# Altium schematic sheet Power_Supply.SchDoc
size B
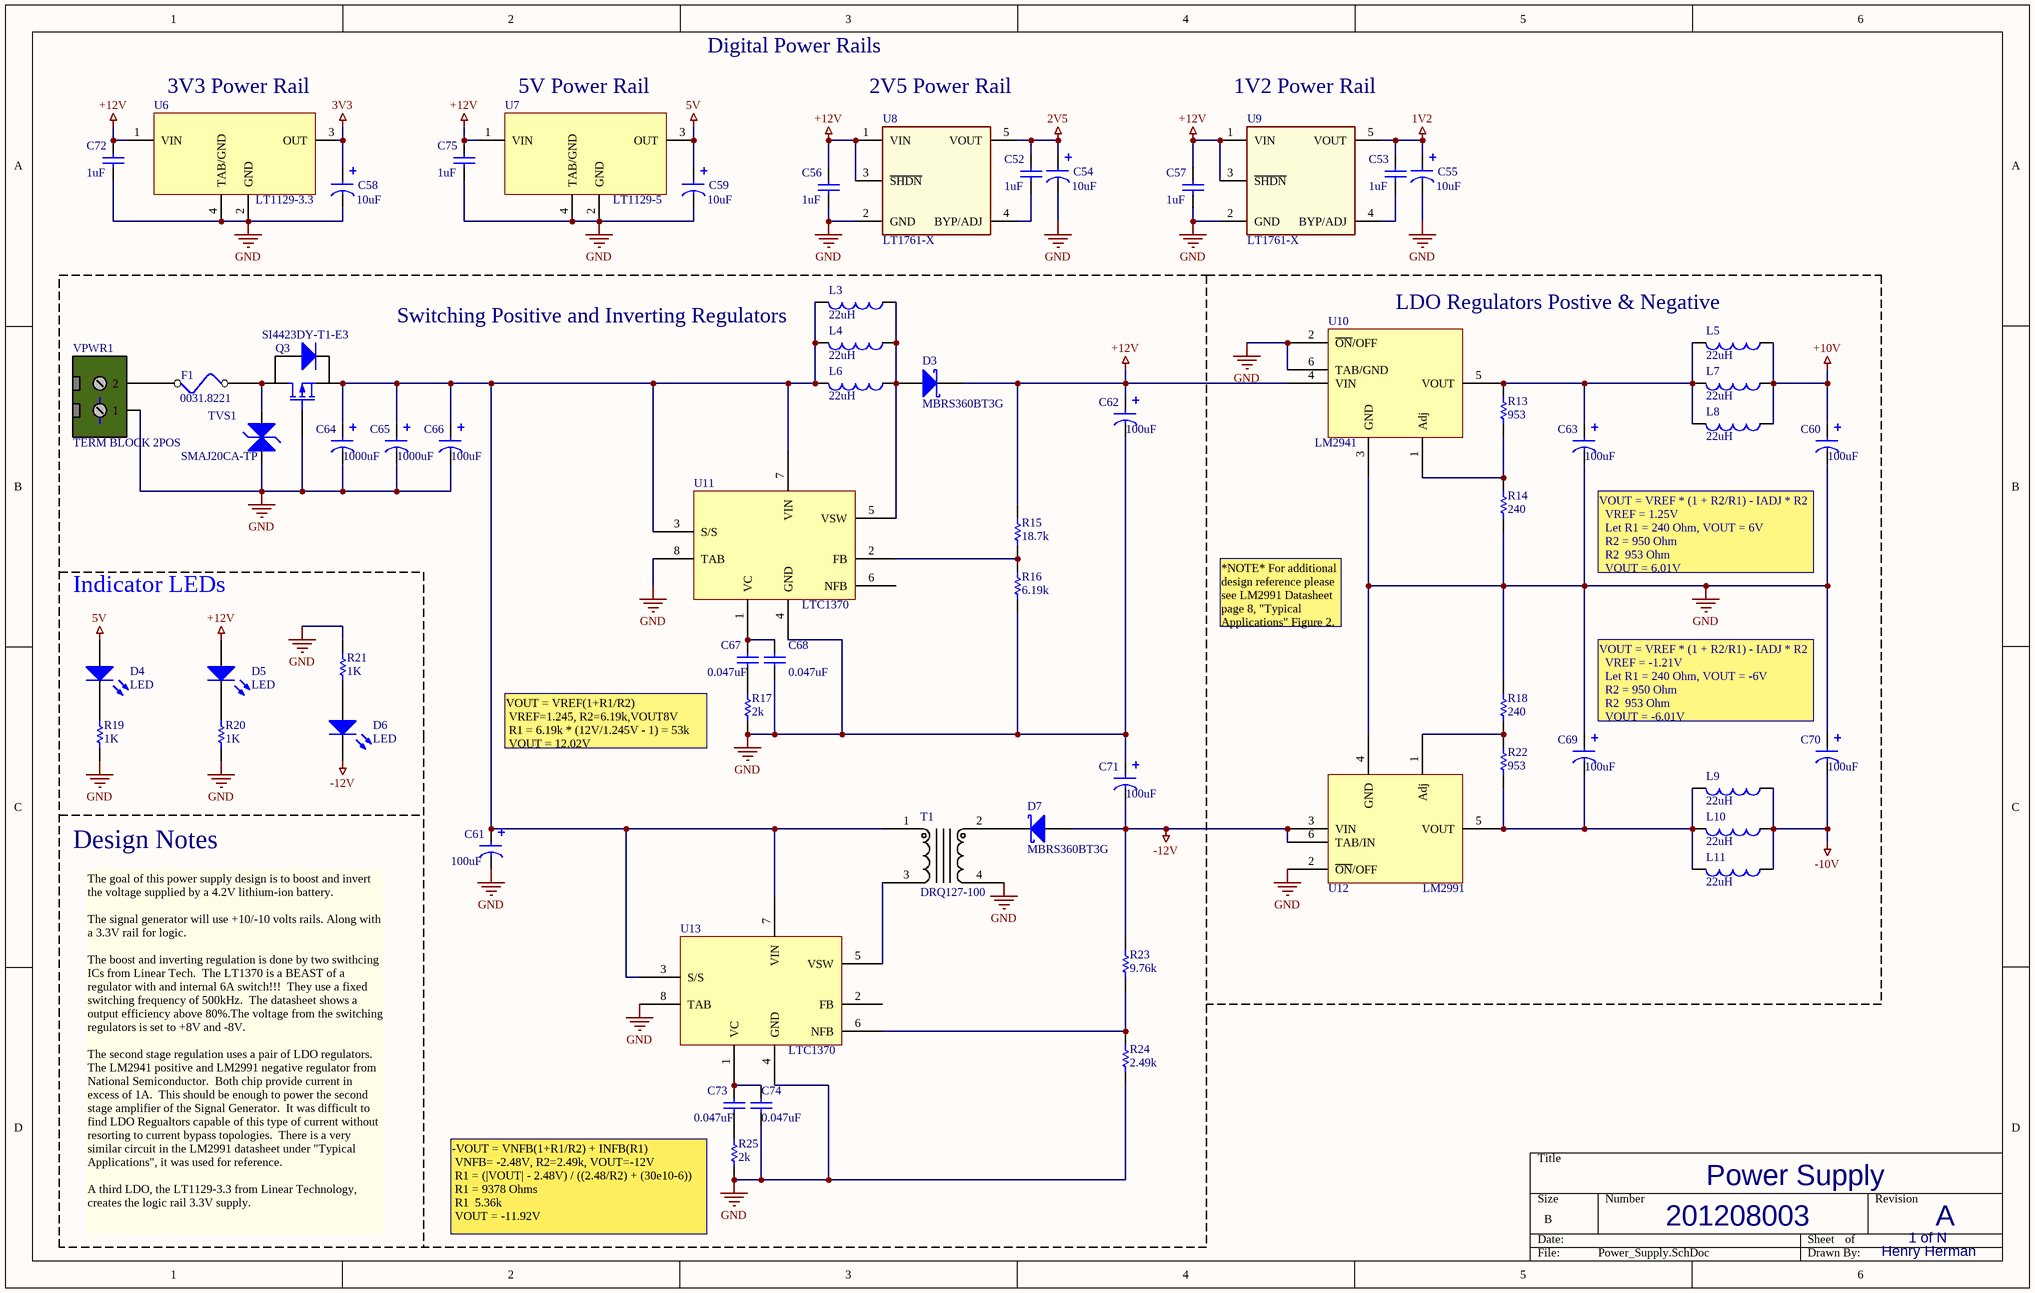
[diagram p0: Power_Supply.SchDoc]

## Parts
C52  Label: 1uF  [SM/C_0603]  (hidden comment: CAP)
C53  Label: 1uF  [SM/C_0603]  (hidden comment: CAP)
C54  Label: 10uF  [SM/C_POL_0805]  (hidden comment: CAP_POL)
C55  Label: 10uF  [SM/C_POL_0805]  (hidden comment: CAP_POL)
C56  Label: 1uF  [SM/C_0603]  (hidden comment: CAP)
C57  Label: 1uF  [SM/C_0603]  (hidden comment: CAP)
C58  value 10uF  [SM/C_POL_0805]  (hidden comment: CAP_POL)
C59  value 10uF  [SM/C_POL_0805]  (hidden comment: CAP_POL)
C60  Label: 100uF  [SM/CT_6032_12]  (hidden comment: CAP_POL)
C61  Label: 100uF  [SM/CT_6032_12]  (hidden comment: CAP_POL)
C62  Label: 100uF  [SM/CT_6032_12]  (hidden comment: CAP_POL)
C63  Label: 100uF  [SM/CT_6032_12]  (hidden comment: CAP_POL)
C64  Label: 1000uF  [CAP-CAN-SMD-POL-12.5mmDia]  (hidden comment: CAP_POL)
C65  Label: 1000uF  [CAP-CAN-SMD-POL-12.5mmDia]  (hidden comment: CAP_POL)
C66  Label: 100uF  [SM/CT_6032_12]  (hidden comment: CAP_POL)
C67  Label: 0.047uF  [SM/C_0603]  (hidden comment: CAP)
C68  Label: 0.047uF  [SM/C_0603]  (hidden comment: CAP)
C69  Label: 100uF  [SM/CT_6032_12]  (hidden comment: CAP_POL)
C70  Label: 100uF  [SM/CT_6032_12]  (hidden comment: CAP_POL)
C71  Label: 100uF  [SM/CT_6032_12]  (hidden comment: CAP_POL)
C72  Label: 1uF  [SM/C_0603]  (hidden comment: CAP)
C73  Label: 0.047uF  [SM/C_0603]  (hidden comment: CAP)
C74  Label: 0.047uF  [SM/C_0603]  (hidden comment: CAP)
C75  Label: 1uF  [SM/C_0603]  (hidden comment: CAP)
D3  MBRS360BT3G  [DPAK-MBRD835L]
D4  LED  [LED-1206]
D5  LED  [LED-1206]
D6  LED  [LED-1206]
D7  MBRS360BT3G  [DPAK-MBRD835L]
F1  0031.8221  [SCHURTER/SMD/2 PADS/0031.8221]
L3  22uH  [G_JMETRIC/TDK/SLE10145]
L4  22uH  [G_JMETRIC/TDK/SLE10145]
L5  22uH  [G_JMETRIC/TDK/SLE10145]
L6  22uH  [G_JMETRIC/TDK/SLE10145]
L7  22uH  [G_JMETRIC/TDK/SLE10145]
L8  22uH  [G_JMETRIC/TDK/SLE10145]
L9  22uH  [G_JMETRIC/TDK/SLE10145]
L10  22uH  [G_JMETRIC/TDK/SLE10145]
L11  22uH  [G_JMETRIC/TDK/SLE10145]
Q3  SI4423DY-T1-E3  [SOIC-8-Lead-Vishay-PFET]
R13  value 953  [SM/R_0603]  (hidden comment: Res)
R14  value 240  [SM/R_0603]  (hidden comment: Res)
R15  value 18.7k  [SM/R_0603]  (hidden comment: Res)
R16  value 6.19k  [SM/R_0603]  (hidden comment: Res)
R17  value 2k  [SM/R_0603]  (hidden comment: Res)
R18  value 240  [SM/R_0603]  (hidden comment: Res)
R19  value 1K  [SM/R_0603]  (hidden comment: Res)
R20  value 1K  [SM/R_0603]  (hidden comment: Res)
R21  value 1K  [SM/R_0603]  (hidden comment: Res)
R22  value 953  [SM/R_0603]  (hidden comment: Res)
R23  value 9.76k  [SM/R_0603]  (hidden comment: Res)
R24  value 2.49k  [SM/R_0603]  (hidden comment: Res)
R25  value 2k  [SM/R_0603]  (hidden comment: Res)
T1  DRQ127-100  [DRQ127-100]
TVS1  SMAJ20CA-TP  [D0-214AC]
U6  LT1129-3.3  [SOT223-3Lead-STPackage-LinearTechLT1129-3.3]
U7  LT1129-5  [SOT223-3Lead-STPackage-LinearTechLT1129-3.3]
U8  LT1761-X  [TSOT-23-5Lead-LTC3406A]
U9  LT1761-X  [TSOT-23-5Lead-LTC3406A]
U10  LM2941  [T0-263- 5Lead - National Semi - LM2941]
U11  LTC1370  [DDPak-7Lead-RPackage-linear]
U12  LM2991  [T0-263 5Lead SMP - National Semi - LM2991S]
U13  LTC1370  [DDPak-7Lead-RPackage-linear]
VPWR1  TERM BLOCK 2POS  [Conn-ScrewTerminal-2pin-Phoenix]

## Blocks framed on the sheet
Design Notes: C61 C62 C64-C68 C71 C73 C74 D3-D7 F1 L3 L4 L6 Q3 R15-R17 R19-R21 R23-R25 T1 TVS1 U11 U13 VPWR1

## Nets
1V2: C53.2 C55.1 U9.5(VOUT)
2V5: C52.2 C54.1 U8.5(VOUT)
3V3: C58.1 U6.3(OUT)
5V: C59.1 D4.1(A) U7.3(OUT)
+10V: C60.1 L5.1 L7.1 L8.1
+12V: C56.2 C57.2 C62.1 C72.2 C75.2 D3.K D5.1(A) R15.2 U6.1(VIN) U7.1(VIN) U8.1(VIN) U8.3(~{SHDN}) U9.1(VIN) U9.3(~{SHDN}) U10.4(VIN)
-10V: C70.2 L9.1 L10.1 L11.1
-12V: C71.2 D6.2(K) D7.A R23.2 U12.3(VIN) U12.6(TAB/IN)
GND: C54.2 C55.2 C56.1 C57.1 C58.2 C59.2 C60.2 C61.2 C62.2 C63.2 C64.2 C65.2 C66.2 C68.1 C69.1 C70.1 C71.1 C72.1 C74.1 C75.1 Q3.G R14.1 R16.1 R17.1 R18.2 R19.1 R20.1 R21.2 R24.1 R25.1 T1.4 TVS1.C U6.2(GND) U6.4(TAB/GND) U7.2(GND) U7.4(TAB/GND) U8.2(GND) U9.2(GND) U10.2(~{ON}/OFF) U10.3(GND) U10.6(TAB/GND) U11.4(GND) U11.8(TAB) U12.2(~{ON}/OFF) U12.4(GND) U13.4(GND) U13.8(TAB) VPWR1.1
NetC52_1: C52.1 U8.4(BYP/ADJ)
NetC53_1: C53.1 U9.4(BYP/ADJ)
NetC61_1: C61.1 C64.1 C65.1 C66.1 L3.2 L4.2 L6.2 Q3.S T1.1(P1) U11.3(S/S) U11.7(VIN) U13.3(S/S) U13.7(VIN)
NetC63_1: C63.1 L5.2 L7.2 L8.2 R13.2 U10.5(VOUT)
NetC67_1: C67.1 R17.2
NetC67_2: C67.2 C68.2 U11.1(VC)
NetC69_2: C69.2 L9.2 L10.2 L11.2 R22.1 U12.5(VOUT)
NetC73_1: C73.1 R25.2
NetC73_2: C73.2 C74.2 U13.1(VC)
NetD3_A: D3.A L3.1 L4.1 L6.1 U11.5(VSW)
NetD4_2: D4.2(K) R19.2
NetD5_2: D5.2(K) R20.2
NetD6_1: D6.1(A) R21.1
NetD7_K: D7.K T1.2
NetF1_1: F1.1 VPWR1.2
NetF1_2: F1.2 Q3.D TVS1.A
NetR13_1: R13.1 R14.2 U10.1(Adj)
NetR15_1: R15.1 R16.2 U11.2(FB)
NetR18_1: R18.1 R22.2 U12.1(Adj)
NetR23_1: R23.1 R24.2 U13.6(NFB)
NetT1_3: T1.3 U13.5(VSW)

Not connected (* = marked no-connect by the designer): U11 6(NFB); U13 2(FB)

## Notes on the sheet
- (near U6) 3V3 Power Rail
- (near U7) 5V Power Rail
- Digital Power Rails
- (near U8) 2V5 Power Rail
- (near U9) 1V2 Power Rail
- (near L3) Switching Positive and Inverting Regulators
- LDO Regulators Postive & Negative
- VOUT = VREF * (1 + R2/R1) - IADJ * R2
  VREF = 1.25V
  Let R1 = 240 Ohm, VOUT = 6V
  R2 = 950 Ohm
  R2  953 Ohm
  VOUT = 6.01V
- Indicator LEDs
- *NOTE* For additional design reference please see LM2991 Datasheet page 8, "Typical Applications" Figure 2.
- VOUT = VREF(1+R1/R2)
  VREF=1.245, R2=6.19k,VOUT8V
  R1 = 6.19k * (12V/1.245V - 1) = 53k
  VOUT = 12.02V
- VOUT = VREF * (1 + R2/R1) - IADJ * R2
  VREF = -1.21V
  Let R1 = 240 Ohm, VOUT = -6V
  R2 = 950 Ohm
  R2  953 Ohm
  VOUT = -6.01V
- The goal of this power supply design is to boost and invert the voltage supplied by a 4.2V lithium-ion battery.
  The signal generator will use +10/-10 volts rails. Along with a 3.3V rail for logic.
  The boost and inverting regulation is done by two swithcing ICs from Linear Tech.  The LT1370 is a BEAST of a regulator with and internal 6A switch!!!  They use a fixed switching frequency of 500kHz.  The datasheet shows a output efficiency above 80%.The voltage from the switching regulators is set to +8V and -8V.
  The second stage regulation uses a pair of LDO regulators.  The LM2941 positive and LM2991 negative regulator from National Semiconductor.  Both chip provide current in excess of 1A.  This should be enough to power the second stage amplifier of the Signal Generator.  It was difficult to find LDO Regualtors capable of this type of current without resorting to current bypass topologies.  There is a very similar circuit in the LM2991 datasheet under "Typical Applications", it was used for reference.
  A third LDO, the LT1129-3.3 from Linear Technology, creates the logic rail 3.3V supply.
- -VOUT = VNFB(1+R1/R2) + INFB(R1)
  VNFB= -2.48V, R2=2.49k, VOUT=-12V
  R1 = (|VOUT| - 2.48V) / ((2.48/R2) + (30e10-6))
  R1 = 9378 Ohms
  R1  5.36k
  VOUT = -11.92V
- 201208003
- Power Supply
- 1 of N
- A
- Henry Herman

## Library data of the parts
C52 C53 C56 C57 C72 C75 = CAP: Value: 1uF
C54 C55 C58 C59 = CAP_POL: CAP; Value: 10uF
  C58 C59: Label: 10uF
C60-C63 C66 C69-C71 = CAP_POL: CAP; Value: 100uF
C64 C65 = CAP_POL: CAP; Value: 1000uF
C67 C68 C73 C74 = CAP: Value: 0.047uF
D3 D7 = Schottky Diode
F1 = 2105: FUSEHOLDER BLACK FOR SMD 5X20MM; mfrName: Schurter Inc; Extra_Description: Standard Package == 100 / Category == Circuit Protection / Family == Fuseholders / Series == OGN / Type == Holder / Fuse Size == 5mm x 20mm / Number of Circuits == 1 / Mounting Type == Surface Mount / Termination Style == Surface Mount (SMD,SMT) / Voltage == 500V / Current Rating == 10A / Material == Copper Alloy, Tin Plated / Catalog Page == 2139 (US2010 Interactive) / Other Names == 0031.8221-ND486-1260; Obsolete: False; Temp_Max: 0; Type: Fuseholders; TypeNotes: Added 12/11/2010 2:44:25 PM; PartID: 2105; mfrPartNum: 0031.8221; URL_Image: HTTP://MEDIA.DIGIKEY.COM/PHOTOS/SCHURTER%20PHOTOS/0031.8221.JPG; URL_Datasheet: http://www.schurterinc.com/var/schurter/storage/ilcatalogue/files/document/datasheet/en/pdf/typ_OGN-SMD.pdf; Date_Created: 12/11/2010 2:47:02 PM; Date_LastModified: 12/11/2010 2:47:02 PM; Verified: False; RoHS: True; Temp_Min: 0
L3-L11 = 1660: INDUCTOR SHIELD PWR 22UH 10145; mfrName: TDK Corporation; mfrPartNum: SLF10145T-220M1R9-PF; Extra_Description: TDK Corporation / Inductance22µH / Tolerance±20% / SeriesSLF / Package / Case10.1mm x 10.1mm x 4.5mm / PackagingCut Tape (CT) / TypeFerrite Core / Current1.9A / Lead Free StatusLead Free / RoHS StatusRoHS Compliant / Other Names445-1981-1; Type: Fixed; PartID: 1660; URL_Datasheet: http://www.digikey.com/scripts/DkSearch/dksus.dll?Pname?Name=445-1981-1-ND&Site=US; Date_Created: 4/21/2006 2:20:33 PM; Date_LastModified: 8/21/2009 1:12:56 AM; Verified: False
Q3 = 2390: mosfet,p ch,20v,10a,8soic; transistor polarity:p channel;; mfrName: Vishay; Extra_Description: MOSFET,P CH,20V,10A,8SOIC; Transistor Polarity:P Channel; Drain Source Voltage Vds:-20V; On Resistance Rds(on):6mohm; Rds(on) Test Voltage Vgs:-4.5V; Operating Temperature Range:-55°C to +150°C; Transistor Case Style:SOIC; No. of Pins:8; SVHC:No SVHC (15-Dec-2010); Current Id Max:-10A; Power Dissipation Pd:1.5W; Voltage Vgs Max:-8V / Polarity: ``P-Channel`` / Case / Package: ``SO-8`` / Packaging: ``Reel`` / Lead-Free Status: ``Lead Free`` / RoHS: ``Compliant`` / Id [Continuous Drain Current]: { / ``uncertainty_minus``: null, / ``value``: -14.0, / ``uncertainty_plus``: null / } / Rds [Drain to Source Resistance] (on): { / ``uncertainty_minus``: null, / ``value``: 0.0075, / ``uncertainty_plus``: null / } / Vds [Drain to Source Voltage]: { / ``uncertainty_minus``: null, / ``value``: -20.0, / ``uncertainty_plus``: null / } / Power Dissipation: { / ``uncertainty_minus``: null, / ``value``: 1.5, / ``uncertainty_plus``: null / } / Breakdown Voltage [Gate to Source]: { / ``max_value``: 8.0, / ``max_uncertainty_plus``: null, / ``min_value``: -8.0, / ``min_uncertainty_plus``: null, / ``max_uncertainty_minus``: null / } / Number of Pins: 8; Obsolete: False; Temp_Max: 0; Type: All Parts; TypeNotes: Applies to all parts in the database; PartID: 2390; mfrPartNum: SI4423DY-T1-E3; URL_Image: http://cdn.sigma.octopart.com/9542269/image/Vishay-SI4423DY-T1-E3.jpg; URL_Datasheet: http://datasheet.octopart.com/SI4423DY-T1-E3-Vishay-datasheet-8542980.pdf; Date_Created: 8/20/2011 8:24:30 AM; Date_LastModified: 8/20/2011 8:24:30 AM; Verified: False; RoHS: True; Temp_Min: 0
R13-R25 = Res: Resistor; Published: 8-Jun-2000; LatestRevisionDate: 17-Jul-2002; LatestRevisionNote: Re-released for DXP Platform.; PackageReference: AXIAL-0.3; Publisher: Altium Limited
T1 = DRQ127-100-XFORM-1:1
TVS1 = 2519: TVS 400W 12V BIDIRECT SMA; mfrName: Micro Commercial Co.; mfrPartNum: SMAJ12CA-TP; Extra_Description: Datasheets	SMAJ5.0 thru SMAJ440CA / Product Photos	SMA, DO-214AC BIDIRECT / Product Training Modules	Transient Voltage Suppressors / Diode Handling and Mounting / Catalog Drawings	SMA Series Top / Featured Product	Surface Mount TVS / Standard Package	1 / Category	Circuit Protection / Family	TVS - Diodes / Series	- / Voltage - Reverse Standoff (Typ)	12V / Voltage - Breakdown	13.3V / Power (Watts)	400W / Polarization	Bidirectional / Mounting Type	Surface Mount / Package / Case	DO-214AC, SMA / Supplier Device Package	SMA / Packaging	Cut Tape (CT) / Other Names	SMAJ12CA-TPMSCT; Obsolete: False; Temp_Max: 0; TypeNotes: Applies to all parts in the database; PartID: 2519; URL_Image: http://media.digikey.com/photos/Micro%20Commercial%20Photos/SMAJ8.5CA-TP.JPG; URL_Datasheet: http://61.222.192.61/mccsemi/up_pdf/SMAJ5.0~SMAJ440CA(SMA).pdf; Date_Created: 2/24/2012 10:06:52 PM; Date_LastModified: 2/24/2012 10:06:52 PM; Verified: False; RoHS: True; Temp_Min: 0; Type: All Parts
U10 = LM2941-LDO Regulator
U11 U13 = LT1370
U12 = LM2991-Negative LDO Regulator
VPWR1 = 2Pin-PhoenixTerminalBlock